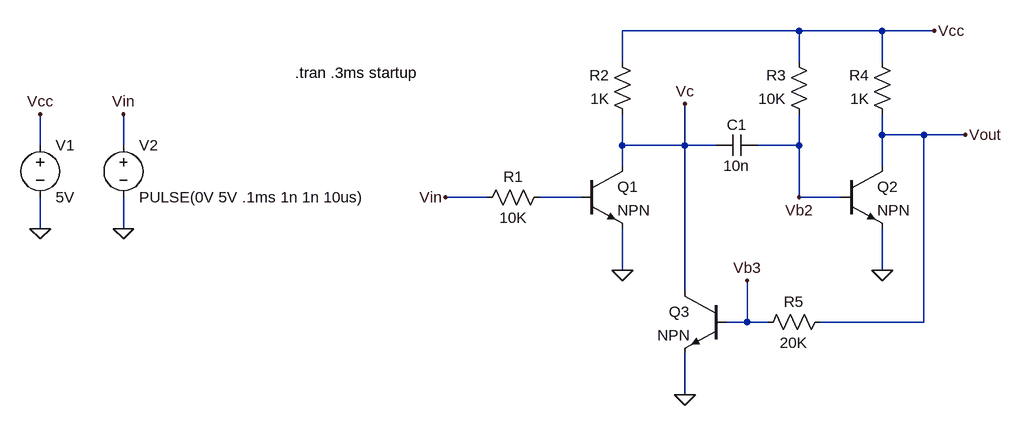
[diagram p0: schematic figure-2.12-pulse-generator-II.asc]
figure-2.12-pulse-generator-II.asc, the LTspice schematic file:
Version 4
SHEET 1 880 680
WIRE 368 -96 96 -96
WIRE 496 -96 368 -96
WIRE 576 -96 496 -96
WIRE 96 -48 96 -96
WIRE 368 -48 368 -96
WIRE 496 -48 496 -96
WIRE 496 64 496 32
WIRE 560 64 496 64
WIRE 624 64 560 64
WIRE -800 80 -800 32
WIRE -672 80 -672 32
WIRE 96 80 96 32
WIRE 192 80 192 16
WIRE 192 80 96 80
WIRE 240 80 192 80
WIRE 368 80 368 32
WIRE 368 80 304 80
WIRE 96 112 96 80
WIRE 496 112 496 64
WIRE -112 160 -176 160
WIRE 32 160 -32 160
WIRE 368 160 368 80
WIRE 432 160 368 160
WIRE -800 208 -800 160
WIRE -672 208 -672 160
WIRE 96 272 96 208
WIRE 496 272 496 208
WIRE 192 304 192 80
WIRE 288 352 288 288
WIRE 288 352 256 352
WIRE 320 352 288 352
WIRE 560 352 560 64
WIRE 560 352 400 352
WIRE 192 464 192 400
FLAG 496 272 0
FLAG 96 272 0
FLAG 576 -96 Vcc
FLAG -176 160 Vin
FLAG 624 64 Vout
FLAG -800 208 0
FLAG -672 208 0
FLAG -672 32 Vin
FLAG -800 32 Vcc
FLAG 368 160 Vb2
FLAG 192 464 0
FLAG 288 288 Vb3
FLAG 192 16 Vc
SYMBOL npn 432 112 R0
SYMATTR InstName Q2
SYMBOL res -16 144 R90
WINDOW 0 0 56 VBottom 2
WINDOW 3 32 56 VTop 2
SYMATTR InstName R1
SYMATTR Value 10K
SYMBOL res 112 48 R180
WINDOW 0 36 76 Left 2
WINDOW 3 36 40 Left 2
SYMATTR InstName R2
SYMATTR Value 1K
SYMBOL res 384 48 R180
WINDOW 0 36 76 Left 2
WINDOW 3 36 40 Left 2
SYMATTR InstName R3
SYMATTR Value 10K
SYMBOL res 512 48 R180
WINDOW 0 36 76 Left 2
WINDOW 3 36 40 Left 2
SYMATTR InstName R4
SYMATTR Value 1K
SYMBOL cap 304 64 R90
WINDOW 0 0 32 VBottom 2
WINDOW 3 32 32 VTop 2
SYMATTR InstName C1
SYMATTR Value 10n
SYMBOL npn 32 112 R0
SYMATTR InstName Q1
SYMBOL voltage -800 64 R0
WINDOW 123 0 0 Left 0
WINDOW 39 0 0 Left 0
SYMATTR InstName V1
SYMATTR Value 5V
SYMBOL voltage -672 64 R0
WINDOW 123 0 0 Left 0
WINDOW 39 0 0 Left 0
SYMATTR InstName V2
SYMATTR Value PULSE(0V 5V .1ms 1n 1n 10us)
SYMBOL npn 256 304 M0
SYMATTR InstName Q3
SYMBOL res 416 336 R90
WINDOW 0 0 56 VBottom 2
WINDOW 3 32 56 VTop 2
SYMATTR InstName R5
SYMATTR Value 20K
TEXT -408 -32 Left 2 !.tran .3ms startup

The netlist it stands for:
* figure-2.12-pulse-generator-II.asc
Q2 Vout Vb2 0 0 NPN
R1 N001 Vin 10K
R2 Vc Vcc 1K
R3 Vb2 Vcc 10K
R4 Vout Vcc 1K
C1 Vb2 Vc 10n
Q1 Vc N001 0 0 NPN
V1 Vcc 0 5V
V2 Vin 0 PULSE(0V 5V .1ms 1n 1n 10us)
Q3 Vc Vb3 0 0 NPN
R5 Vout Vb3 20K
.model NPN NPN
.model PNP PNP
.lib standard.bjt
.tran .3ms startup
.backanno
.end

* Results of the author's LTspice run, read from the files saved beside the schematic
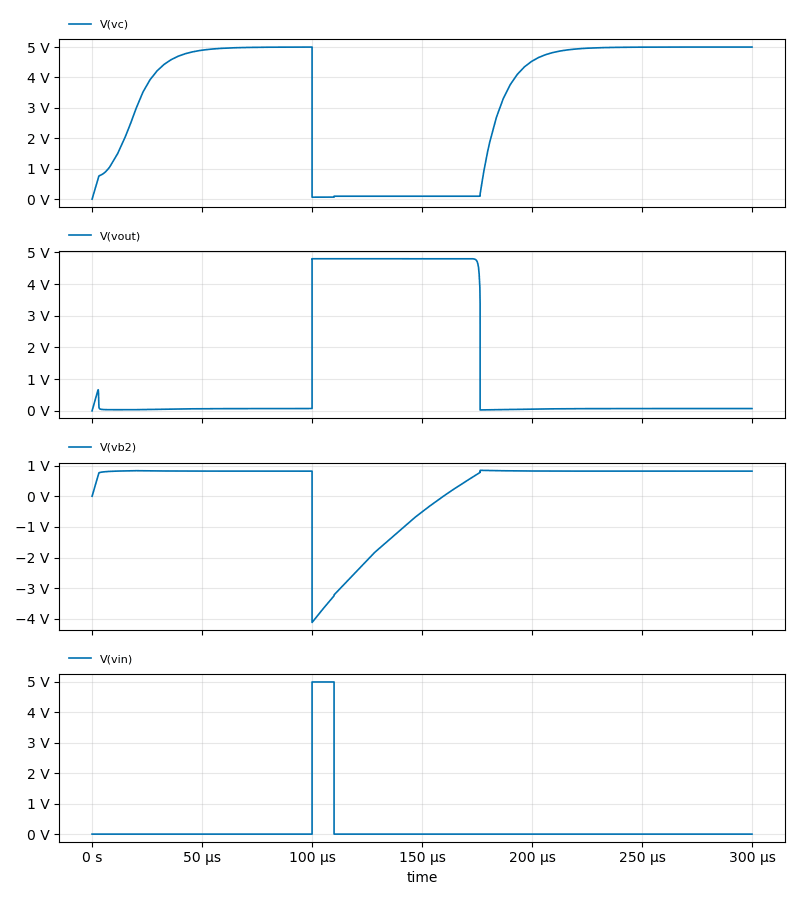
[diagram p1: Transient Analysis of figure-2.12-pulse-generator-II.asc, plotted from the saved traces]
* Transient Analysis, 1 run:
*   V(vc): min 0 V, max 5 V, average 3.281 V, rms 3.912 V, last 5 V
*   V(vout): min 0 V, max 4.801 V, average 1.269 V, rms 2.42 V, last 71.11 mV
*   V(vb2): min -4.115 V, max 844.5 mV, average 260.1 mV, rms 1.228 V, last 819 mV
*   V(vin): min 0 V, max 5 V, average 166.7 mV, rms 912.9 mV, last 0 V